# EAGLE schematic untitled (EAGLE 9.6.2)
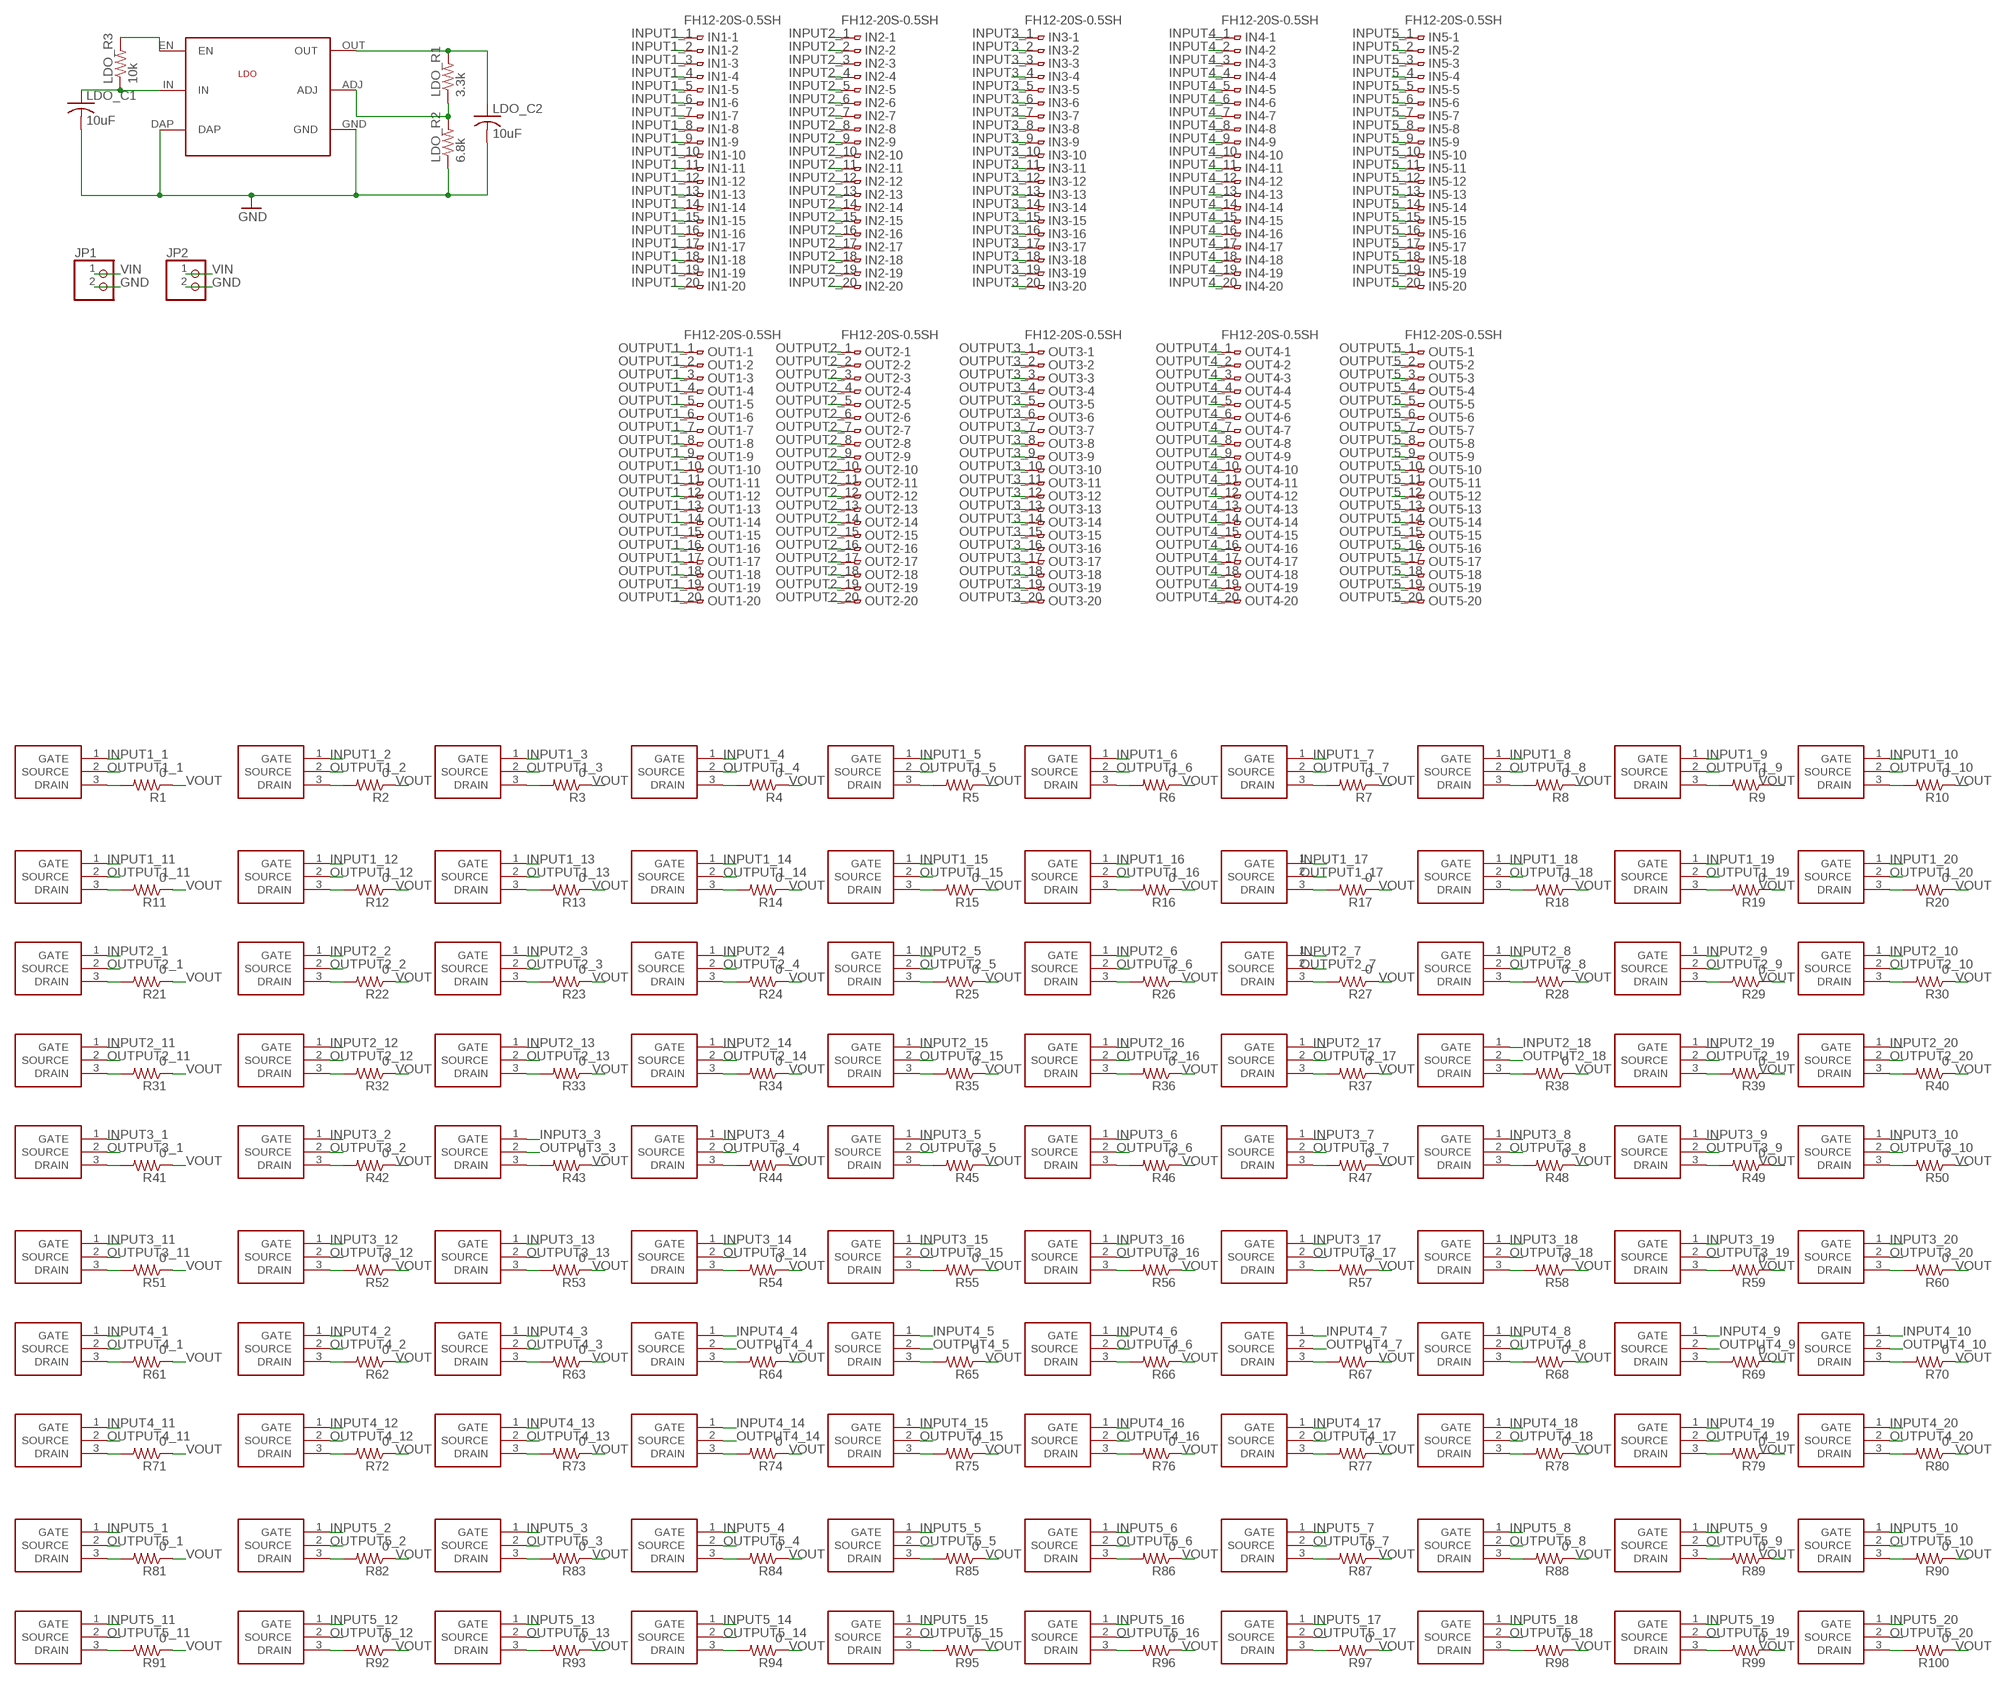
[diagram p0: schematic, sheet 1]

## Parts
IN1  FH12-20S-0.5SH  [FH12-20S-0.5SH]
IN2  FH12-20S-0.5SH  [FH12-20S-0.5SH]
IN3  FH12-20S-0.5SH  [FH12-20S-0.5SH]
IN4  FH12-20S-0.5SH  [FH12-20S-0.5SH]
IN5  FH12-20S-0.5SH  [FH12-20S-0.5SH]
JP1  PINHD-1X2  [1X02]
JP2  PINHD-1X2  [1X02]
LDO  LP38501TS_ADJ  [LP38501TS_ADJ]
LDO_C1  10uF  C-USC0805  [C0805]
LDO_C2  10uF  C-USC0805  [C0805]
LDO_R1  3.3k  R-US_R0805  [R0805]
LDO_R2  6.8k  R-US_R0805  [R0805]
LDO_R3  10k  R-US_R0805  [R0805]
MOS1  NX6008NBKNX6008NBK  [SOT95P240X110-3N]
MOS2  NX6008NBKNX6008NBK  [SOT95P240X110-3N]
MOS3  NX6008NBKNX6008NBK  [SOT95P240X110-3N]
MOS4  NX6008NBKNX6008NBK  [SOT95P240X110-3N]
MOS5  NX6008NBKNX6008NBK  [SOT95P240X110-3N]
MOS6  NX6008NBKNX6008NBK  [SOT95P240X110-3N]
MOS7  NX6008NBKNX6008NBK  [SOT95P240X110-3N]
MOS8  NX6008NBKNX6008NBK  [SOT95P240X110-3N]
MOS9  NX6008NBKNX6008NBK  [SOT95P240X110-3N]
MOS10  NX6008NBKNX6008NBK  [SOT95P240X110-3N]
MOS11  NX6008NBKNX6008NBK  [SOT95P240X110-3N]
MOS12  NX6008NBKNX6008NBK  [SOT95P240X110-3N]
MOS13  NX6008NBKNX6008NBK  [SOT95P240X110-3N]
MOS14  NX6008NBKNX6008NBK  [SOT95P240X110-3N]
MOS15  NX6008NBKNX6008NBK  [SOT95P240X110-3N]
MOS16  NX6008NBKNX6008NBK  [SOT95P240X110-3N]
MOS17  NX6008NBKNX6008NBK  [SOT95P240X110-3N]
MOS18  NX6008NBKNX6008NBK  [SOT95P240X110-3N]
MOS19  NX6008NBKNX6008NBK  [SOT95P240X110-3N]
MOS20  NX6008NBKNX6008NBK  [SOT95P240X110-3N]
MOS21  NX6008NBKNX6008NBK  [SOT95P240X110-3N]
MOS22  NX6008NBKNX6008NBK  [SOT95P240X110-3N]
MOS23  NX6008NBKNX6008NBK  [SOT95P240X110-3N]
MOS24  NX6008NBKNX6008NBK  [SOT95P240X110-3N]
MOS25  NX6008NBKNX6008NBK  [SOT95P240X110-3N]
MOS26  NX6008NBKNX6008NBK  [SOT95P240X110-3N]
MOS27  NX6008NBKNX6008NBK  [SOT95P240X110-3N]
MOS28  NX6008NBKNX6008NBK  [SOT95P240X110-3N]
MOS29  NX6008NBKNX6008NBK  [SOT95P240X110-3N]
MOS30  NX6008NBKNX6008NBK  [SOT95P240X110-3N]
MOS31  NX6008NBKNX6008NBK  [SOT95P240X110-3N]
MOS32  NX6008NBKNX6008NBK  [SOT95P240X110-3N]
MOS33  NX6008NBKNX6008NBK  [SOT95P240X110-3N]
MOS34  NX6008NBKNX6008NBK  [SOT95P240X110-3N]
MOS35  NX6008NBKNX6008NBK  [SOT95P240X110-3N]
MOS36  NX6008NBKNX6008NBK  [SOT95P240X110-3N]
MOS37  NX6008NBKNX6008NBK  [SOT95P240X110-3N]
MOS38  NX6008NBKNX6008NBK  [SOT95P240X110-3N]
MOS39  NX6008NBKNX6008NBK  [SOT95P240X110-3N]
MOS40  NX6008NBKNX6008NBK  [SOT95P240X110-3N]
MOS41  NX6008NBKNX6008NBK  [SOT95P240X110-3N]
MOS42  NX6008NBKNX6008NBK  [SOT95P240X110-3N]
MOS43  NX6008NBKNX6008NBK  [SOT95P240X110-3N]
MOS44  NX6008NBKNX6008NBK  [SOT95P240X110-3N]
MOS45  NX6008NBKNX6008NBK  [SOT95P240X110-3N]
MOS46  NX6008NBKNX6008NBK  [SOT95P240X110-3N]
MOS47  NX6008NBKNX6008NBK  [SOT95P240X110-3N]
MOS48  NX6008NBKNX6008NBK  [SOT95P240X110-3N]
MOS49  NX6008NBKNX6008NBK  [SOT95P240X110-3N]
MOS50  NX6008NBKNX6008NBK  [SOT95P240X110-3N]
MOS51  NX6008NBKNX6008NBK  [SOT95P240X110-3N]
MOS52  NX6008NBKNX6008NBK  [SOT95P240X110-3N]
MOS53  NX6008NBKNX6008NBK  [SOT95P240X110-3N]
MOS54  NX6008NBKNX6008NBK  [SOT95P240X110-3N]
MOS55  NX6008NBKNX6008NBK  [SOT95P240X110-3N]
MOS56  NX6008NBKNX6008NBK  [SOT95P240X110-3N]
MOS57  NX6008NBKNX6008NBK  [SOT95P240X110-3N]
MOS58  NX6008NBKNX6008NBK  [SOT95P240X110-3N]
MOS59  NX6008NBKNX6008NBK  [SOT95P240X110-3N]
MOS60  NX6008NBKNX6008NBK  [SOT95P240X110-3N]
MOS61  NX6008NBKNX6008NBK  [SOT95P240X110-3N]
MOS62  NX6008NBKNX6008NBK  [SOT95P240X110-3N]
MOS63  NX6008NBKNX6008NBK  [SOT95P240X110-3N]
MOS64  NX6008NBKNX6008NBK  [SOT95P240X110-3N]
MOS65  NX6008NBKNX6008NBK  [SOT95P240X110-3N]
MOS66  NX6008NBKNX6008NBK  [SOT95P240X110-3N]
MOS67  NX6008NBKNX6008NBK  [SOT95P240X110-3N]
MOS68  NX6008NBKNX6008NBK  [SOT95P240X110-3N]
MOS69  NX6008NBKNX6008NBK  [SOT95P240X110-3N]
MOS70  NX6008NBKNX6008NBK  [SOT95P240X110-3N]
MOS71  NX6008NBKNX6008NBK  [SOT95P240X110-3N]
MOS72  NX6008NBKNX6008NBK  [SOT95P240X110-3N]
MOS73  NX6008NBKNX6008NBK  [SOT95P240X110-3N]
MOS74  NX6008NBKNX6008NBK  [SOT95P240X110-3N]
MOS75  NX6008NBKNX6008NBK  [SOT95P240X110-3N]
MOS76  NX6008NBKNX6008NBK  [SOT95P240X110-3N]
MOS77  NX6008NBKNX6008NBK  [SOT95P240X110-3N]
MOS78  NX6008NBKNX6008NBK  [SOT95P240X110-3N]
MOS79  NX6008NBKNX6008NBK  [SOT95P240X110-3N]
MOS80  NX6008NBKNX6008NBK  [SOT95P240X110-3N]
MOS81  NX6008NBKNX6008NBK  [SOT95P240X110-3N]
MOS82  NX6008NBKNX6008NBK  [SOT95P240X110-3N]
MOS83  NX6008NBKNX6008NBK  [SOT95P240X110-3N]
MOS84  NX6008NBKNX6008NBK  [SOT95P240X110-3N]
MOS85  NX6008NBKNX6008NBK  [SOT95P240X110-3N]
MOS86  NX6008NBKNX6008NBK  [SOT95P240X110-3N]
MOS87  NX6008NBKNX6008NBK  [SOT95P240X110-3N]
MOS88  NX6008NBKNX6008NBK  [SOT95P240X110-3N]
MOS89  NX6008NBKNX6008NBK  [SOT95P240X110-3N]
MOS90  NX6008NBKNX6008NBK  [SOT95P240X110-3N]
MOS91  NX6008NBKNX6008NBK  [SOT95P240X110-3N]
MOS92  NX6008NBKNX6008NBK  [SOT95P240X110-3N]
MOS93  NX6008NBKNX6008NBK  [SOT95P240X110-3N]
MOS94  NX6008NBKNX6008NBK  [SOT95P240X110-3N]
MOS95  NX6008NBKNX6008NBK  [SOT95P240X110-3N]
MOS96  NX6008NBKNX6008NBK  [SOT95P240X110-3N]
MOS97  NX6008NBKNX6008NBK  [SOT95P240X110-3N]
MOS98  NX6008NBKNX6008NBK  [SOT95P240X110-3N]
MOS99  NX6008NBKNX6008NBK  [SOT95P240X110-3N]
MOS100  NX6008NBKNX6008NBK  [SOT95P240X110-3N]
OUT1  FH12-20S-0.5SH  [FH12-20S-0.5SH]
OUT2  FH12-20S-0.5SH  [FH12-20S-0.5SH]
OUT3  FH12-20S-0.5SH  [FH12-20S-0.5SH]
OUT4  FH12-20S-0.5SH  [FH12-20S-0.5SH]
OUT5  FH12-20S-0.5SH  [FH12-20S-0.5SH]
R1  0  R-US_R0805  [R0805]
R2  0  R-US_R0805  [R0805]
R3  0  R-US_R0805  [R0805]
R4  0  R-US_R0805  [R0805]
R5  0  R-US_R0805  [R0805]
R6  0  R-US_R0805  [R0805]
R7  0  R-US_R0805  [R0805]
R8  0  R-US_R0805  [R0805]
R9  0  R-US_R0805  [R0805]
R10  0  R-US_R0805  [R0805]
R11  0  R-US_R0805  [R0805]
R12  0  R-US_R0805  [R0805]
R13  0  R-US_R0805  [R0805]
R14  0  R-US_R0805  [R0805]
R15  0  R-US_R0805  [R0805]
R16  0  R-US_R0805  [R0805]
R17  0  R-US_R0805  [R0805]
R18  0  R-US_R0805  [R0805]
R19  0  R-US_R0805  [R0805]
R20  0  R-US_R0805  [R0805]
R21  0  R-US_R0805  [R0805]
R22  0  R-US_R0805  [R0805]
R23  0  R-US_R0805  [R0805]
R24  0  R-US_R0805  [R0805]
R25  0  R-US_R0805  [R0805]
R26  0  R-US_R0805  [R0805]
R27  0  R-US_R0805  [R0805]
R28  0  R-US_R0805  [R0805]
R29  0  R-US_R0805  [R0805]
R30  0  R-US_R0805  [R0805]
R31  0  R-US_R0805  [R0805]
R32  0  R-US_R0805  [R0805]
R33  0  R-US_R0805  [R0805]
R34  0  R-US_R0805  [R0805]
R35  0  R-US_R0805  [R0805]
R36  0  R-US_R0805  [R0805]
R37  0  R-US_R0805  [R0805]
R38  0  R-US_R0805  [R0805]
R39  0  R-US_R0805  [R0805]
R40  0  R-US_R0805  [R0805]
R41  0  R-US_R0805  [R0805]
R42  0  R-US_R0805  [R0805]
R43  0  R-US_R0805  [R0805]
R44  0  R-US_R0805  [R0805]
R45  0  R-US_R0805  [R0805]
R46  0  R-US_R0805  [R0805]
R47  0  R-US_R0805  [R0805]
R48  0  R-US_R0805  [R0805]
R49  0  R-US_R0805  [R0805]
R50  0  R-US_R0805  [R0805]
R51  0  R-US_R0805  [R0805]
R52  0  R-US_R0805  [R0805]
R53  0  R-US_R0805  [R0805]
R54  0  R-US_R0805  [R0805]
R55  0  R-US_R0805  [R0805]
R56  0  R-US_R0805  [R0805]
R57  0  R-US_R0805  [R0805]
R58  0  R-US_R0805  [R0805]
R59  0  R-US_R0805  [R0805]
R60  0  R-US_R0805  [R0805]
R61  0  R-US_R0805  [R0805]
R62  0  R-US_R0805  [R0805]
R63  0  R-US_R0805  [R0805]
R64  0  R-US_R0805  [R0805]
R65  0  R-US_R0805  [R0805]
R66  0  R-US_R0805  [R0805]
R67  0  R-US_R0805  [R0805]
R68  0  R-US_R0805  [R0805]
R69  0  R-US_R0805  [R0805]
R70  0  R-US_R0805  [R0805]
R71  0  R-US_R0805  [R0805]
R72  0  R-US_R0805  [R0805]
R73  0  R-US_R0805  [R0805]
R74  0  R-US_R0805  [R0805]
R75  0  R-US_R0805  [R0805]
R76  0  R-US_R0805  [R0805]
R77  0  R-US_R0805  [R0805]
R78  0  R-US_R0805  [R0805]
R79  0  R-US_R0805  [R0805]
R80  0  R-US_R0805  [R0805]
R81  0  R-US_R0805  [R0805]
R82  0  R-US_R0805  [R0805]
R83  0  R-US_R0805  [R0805]
R84  0  R-US_R0805  [R0805]
R85  0  R-US_R0805  [R0805]
R86  0  R-US_R0805  [R0805]
R87  0  R-US_R0805  [R0805]
R88  0  R-US_R0805  [R0805]
R89  0  R-US_R0805  [R0805]
R90  0  R-US_R0805  [R0805]
R91  0  R-US_R0805  [R0805]
R92  0  R-US_R0805  [R0805]
R93  0  R-US_R0805  [R0805]
R94  0  R-US_R0805  [R0805]
R95  0  R-US_R0805  [R0805]
R96  0  R-US_R0805  [R0805]
R97  0  R-US_R0805  [R0805]
R98  0  R-US_R0805  [R0805]
R99  0  R-US_R0805  [R0805]
R100  0  R-US_R0805  [R0805]

## Nets
GND: JP1.2 JP2.2 LDO.DAP LDO.GND LDO_C1.2 LDO_C2.2 LDO_R2.1
INPUT1_1: IN1.1 MOS1.1(GATE)
INPUT1_2: IN1.2 MOS2.1(GATE)
INPUT1_3: IN1.3 MOS3.1(GATE)
INPUT1_4: IN1.4 MOS4.1(GATE)
INPUT1_5: IN1.5 MOS5.1(GATE)
INPUT1_6: IN1.6 MOS6.1(GATE)
INPUT1_7: IN1.7 MOS7.1(GATE)
INPUT1_8: IN1.8 MOS8.1(GATE)
INPUT1_9: IN1.9 MOS9.1(GATE)
INPUT1_10: IN1.10 MOS10.1(GATE)
INPUT1_11: IN1.11 MOS11.1(GATE)
INPUT1_12: IN1.12 MOS12.1(GATE)
INPUT1_13: IN1.13 MOS13.1(GATE)
INPUT1_14: IN1.14 MOS14.1(GATE)
INPUT1_15: IN1.15 MOS15.1(GATE)
INPUT1_16: IN1.16 MOS16.1(GATE)
INPUT1_17: IN1.17 MOS17.1(GATE)
INPUT1_18: IN1.18 MOS18.1(GATE)
INPUT1_19: IN1.19 MOS19.1(GATE)
INPUT1_20: IN1.20 MOS20.1(GATE)
INPUT2_1: IN2.1 MOS21.1(GATE)
INPUT2_2: IN2.2 MOS22.1(GATE)
INPUT2_3: IN2.3 MOS23.1(GATE)
INPUT2_4: IN2.4 MOS24.1(GATE)
INPUT2_5: IN2.5 MOS25.1(GATE)
INPUT2_6: IN2.6 MOS26.1(GATE)
INPUT2_7: IN2.7 MOS27.1(GATE)
INPUT2_8: IN2.8 MOS28.1(GATE)
INPUT2_9: IN2.9 MOS29.1(GATE)
INPUT2_10: IN2.10 MOS30.1(GATE)
INPUT2_11: IN2.11 MOS31.1(GATE)
INPUT2_12: IN2.12 MOS32.1(GATE)
INPUT2_13: IN2.13 MOS33.1(GATE)
INPUT2_14: IN2.14 MOS34.1(GATE)
INPUT2_15: IN2.15 MOS35.1(GATE)
INPUT2_16: IN2.16 MOS36.1(GATE)
INPUT2_17: IN2.17 MOS37.1(GATE)
INPUT2_18: IN2.18 MOS38.1(GATE)
INPUT2_19: IN2.19 MOS39.1(GATE)
INPUT2_20: IN2.20 MOS40.1(GATE)
INPUT3_1: IN3.1 MOS41.1(GATE)
INPUT3_2: IN3.2 MOS42.1(GATE)
INPUT3_3: IN3.3 MOS43.1(GATE)
INPUT3_4: IN3.4 MOS44.1(GATE)
INPUT3_5: IN3.5 MOS45.1(GATE)
INPUT3_6: IN3.6 MOS46.1(GATE)
INPUT3_7: IN3.7 MOS47.1(GATE)
INPUT3_8: IN3.8 MOS48.1(GATE)
INPUT3_9: IN3.9 MOS49.1(GATE)
INPUT3_10: IN3.10 MOS50.1(GATE)
INPUT3_11: IN3.11 MOS51.1(GATE)
INPUT3_12: IN3.12 MOS52.1(GATE)
INPUT3_13: IN3.13 MOS53.1(GATE)
INPUT3_14: IN3.14 MOS54.1(GATE)
INPUT3_15: IN3.15 MOS55.1(GATE)
INPUT3_16: IN3.16 MOS56.1(GATE)
INPUT3_17: IN3.17 MOS57.1(GATE)
INPUT3_18: IN3.18 MOS58.1(GATE)
INPUT3_19: IN3.19 MOS59.1(GATE)
INPUT3_20: IN3.20 MOS60.1(GATE)
INPUT4_1: IN4.1 MOS61.1(GATE)
INPUT4_2: IN4.2 MOS62.1(GATE)
INPUT4_3: IN4.3 MOS63.1(GATE)
INPUT4_4: IN4.4 MOS64.1(GATE)
INPUT4_5: IN4.5 MOS65.1(GATE)
INPUT4_6: IN4.6 MOS66.1(GATE)
INPUT4_7: IN4.7 MOS67.1(GATE)
INPUT4_8: IN4.8 MOS68.1(GATE)
INPUT4_9: IN4.9 MOS69.1(GATE)
INPUT4_10: IN4.10 MOS70.1(GATE)
INPUT4_11: IN4.11 MOS71.1(GATE)
INPUT4_12: IN4.12 MOS72.1(GATE)
INPUT4_13: IN4.13 MOS73.1(GATE)
INPUT4_14: IN4.14 MOS74.1(GATE)
INPUT4_15: IN4.15 MOS75.1(GATE)
INPUT4_16: IN4.16 MOS76.1(GATE)
INPUT4_17: IN4.17 MOS77.1(GATE)
INPUT4_18: IN4.18 MOS78.1(GATE)
INPUT4_19: IN4.19 MOS79.1(GATE)
INPUT4_20: IN4.20 MOS80.1(GATE)
INPUT5_1: IN5.1 MOS81.1(GATE)
INPUT5_2: IN5.2 MOS82.1(GATE)
INPUT5_3: IN5.3 MOS83.1(GATE)
INPUT5_4: IN5.4 MOS84.1(GATE)
INPUT5_5: IN5.5 MOS85.1(GATE)
INPUT5_6: IN5.6 MOS86.1(GATE)
INPUT5_7: IN5.7 MOS87.1(GATE)
INPUT5_8: IN5.8 MOS88.1(GATE)
INPUT5_9: IN5.9 MOS89.1(GATE)
INPUT5_10: IN5.10 MOS90.1(GATE)
INPUT5_11: IN5.11 MOS91.1(GATE)
INPUT5_12: IN5.12 MOS92.1(GATE)
INPUT5_13: IN5.13 MOS93.1(GATE)
INPUT5_14: IN5.14 MOS94.1(GATE)
INPUT5_15: IN5.15 MOS95.1(GATE)
INPUT5_16: IN5.16 MOS96.1(GATE)
INPUT5_17: IN5.17 MOS97.1(GATE)
INPUT5_18: IN5.18 MOS98.1(GATE)
INPUT5_19: IN5.19 MOS99.1(GATE)
INPUT5_20: IN5.20 MOS100.1(GATE)
N$1: LDO.EN LDO_R3.2
N$2: MOS77.3(DRAIN) R77.2
N$3: MOS81.3(DRAIN) R81.2
N$4: LDO.ADJ LDO_R1.1 LDO_R2.2
N$5: MOS1.3(DRAIN) R1.2
N$6: MOS2.3(DRAIN) R2.2
N$7: MOS82.3(DRAIN) R82.2
N$8: MOS83.3(DRAIN) R83.2
N$9: MOS84.3(DRAIN) R84.2
N$10: MOS3.3(DRAIN) R3.2
N$11: MOS85.3(DRAIN) R85.2
N$12: MOS86.3(DRAIN) R86.2
N$13: MOS87.3(DRAIN) R87.2
N$14: MOS4.3(DRAIN) R4.2
N$15: MOS88.3(DRAIN) R88.2
N$16: MOS89.3(DRAIN) R89.2
N$17: MOS90.3(DRAIN) R90.2
N$18: MOS5.3(DRAIN) R5.2
N$19: MOS91.3(DRAIN) R91.2
N$20: MOS92.3(DRAIN) R92.2
N$21: MOS93.3(DRAIN) R93.2
N$22: MOS6.3(DRAIN) R6.2
N$23: MOS94.3(DRAIN) R94.2
N$24: MOS95.3(DRAIN) R95.2
N$25: MOS96.3(DRAIN) R96.2
N$26: MOS7.3(DRAIN) R7.2
N$27: MOS98.3(DRAIN) R98.2
N$28: MOS99.3(DRAIN) R99.2
N$29: MOS100.3(DRAIN) R100.2
N$30: MOS8.3(DRAIN) R8.2
N$31: MOS97.3(DRAIN) R97.2
N$34: MOS9.3(DRAIN) R9.2
N$38: MOS10.3(DRAIN) R10.2
N$40: MOS11.3(DRAIN) R11.2
N$43: MOS12.3(DRAIN) R12.2
N$47: MOS13.3(DRAIN) R13.2
N$51: MOS14.3(DRAIN) R14.2
N$55: MOS15.3(DRAIN) R15.2
N$59: MOS16.3(DRAIN) R16.2
N$63: MOS17.3(DRAIN) R17.2
N$67: MOS18.3(DRAIN) R18.2
N$71: MOS19.3(DRAIN) R19.2
N$75: MOS20.3(DRAIN) R20.2
N$77: MOS21.3(DRAIN) R21.2
N$80: MOS22.3(DRAIN) R22.2
N$84: MOS23.3(DRAIN) R23.2
N$88: MOS24.3(DRAIN) R24.2
N$92: MOS25.3(DRAIN) R25.2
N$96: MOS26.3(DRAIN) R26.2
N$100: MOS27.3(DRAIN) R27.2
N$104: MOS28.3(DRAIN) R28.2
N$108: MOS29.3(DRAIN) R29.2
N$112: MOS30.3(DRAIN) R30.2
N$114: MOS31.3(DRAIN) R31.2
N$117: MOS32.3(DRAIN) R32.2
N$121: MOS33.3(DRAIN) R33.2
N$125: MOS34.3(DRAIN) R34.2
N$129: MOS35.3(DRAIN) R35.2
N$133: MOS36.3(DRAIN) R36.2
N$137: MOS37.3(DRAIN) R37.2
N$141: MOS38.3(DRAIN) R38.2
N$145: MOS39.3(DRAIN) R39.2
N$149: MOS40.3(DRAIN) R40.2
N$151: MOS41.3(DRAIN) R41.2
N$154: MOS42.3(DRAIN) R42.2
N$158: MOS43.3(DRAIN) R43.2
N$162: MOS44.3(DRAIN) R44.2
N$166: MOS45.3(DRAIN) R45.2
N$170: MOS46.3(DRAIN) R46.2
N$174: MOS47.3(DRAIN) R47.2
N$178: MOS48.3(DRAIN) R48.2
N$182: MOS49.3(DRAIN) R49.2
N$186: MOS50.3(DRAIN) R50.2
N$188: MOS51.3(DRAIN) R51.2
N$191: MOS52.3(DRAIN) R52.2
N$195: MOS53.3(DRAIN) R53.2
N$199: MOS54.3(DRAIN) R54.2
N$203: MOS55.3(DRAIN) R55.2
N$207: MOS56.3(DRAIN) R56.2
N$211: MOS57.3(DRAIN) R57.2
N$215: MOS58.3(DRAIN) R58.2
N$219: MOS59.3(DRAIN) R59.2
N$223: MOS60.3(DRAIN) R60.2
N$225: MOS61.3(DRAIN) R61.2
N$228: MOS62.3(DRAIN) R62.2
N$232: MOS63.3(DRAIN) R63.2
N$236: MOS64.3(DRAIN) R64.2
N$240: MOS65.3(DRAIN) R65.2
N$244: MOS66.3(DRAIN) R66.2
N$248: MOS67.3(DRAIN) R67.2
N$252: MOS68.3(DRAIN) R68.2
N$256: MOS69.3(DRAIN) R69.2
N$260: MOS70.3(DRAIN) R70.2
N$262: MOS71.3(DRAIN) R71.2
N$265: MOS72.3(DRAIN) R72.2
N$269: MOS73.3(DRAIN) R73.2
N$273: MOS74.3(DRAIN) R74.2
N$277: MOS75.3(DRAIN) R75.2
N$281: MOS76.3(DRAIN) R76.2
N$289: MOS78.3(DRAIN) R78.2
N$293: MOS79.3(DRAIN) R79.2
N$297: MOS80.3(DRAIN) R80.2
OUTPUT1_1: MOS1.2(SOURCE) OUT1.1
OUTPUT1_2: MOS2.2(SOURCE) OUT1.2
OUTPUT1_3: MOS3.2(SOURCE) OUT1.3
OUTPUT1_4: MOS4.2(SOURCE) OUT1.4
OUTPUT1_5: MOS5.2(SOURCE) OUT1.5
OUTPUT1_6: MOS6.2(SOURCE) OUT1.6
OUTPUT1_7: MOS7.2(SOURCE) OUT1.7
OUTPUT1_8: MOS8.2(SOURCE) OUT1.8
OUTPUT1_9: MOS9.2(SOURCE) OUT1.9
OUTPUT1_10: MOS10.2(SOURCE) OUT1.10
OUTPUT1_11: MOS11.2(SOURCE) OUT1.11
OUTPUT1_12: MOS12.2(SOURCE) OUT1.12
OUTPUT1_13: MOS13.2(SOURCE) OUT1.13
OUTPUT1_14: MOS14.2(SOURCE) OUT1.14
OUTPUT1_15: MOS15.2(SOURCE) OUT1.15
OUTPUT1_16: MOS16.2(SOURCE) OUT1.16
OUTPUT1_17: MOS17.2(SOURCE) OUT1.17
OUTPUT1_18: MOS18.2(SOURCE) OUT1.18
OUTPUT1_19: MOS19.2(SOURCE) OUT1.19
OUTPUT1_20: MOS20.2(SOURCE) OUT1.20
OUTPUT2_1: MOS21.2(SOURCE) OUT2.1
OUTPUT2_2: MOS22.2(SOURCE) OUT2.2
OUTPUT2_3: MOS23.2(SOURCE) OUT2.3
OUTPUT2_4: MOS24.2(SOURCE) OUT2.4
OUTPUT2_5: MOS25.2(SOURCE) OUT2.5
OUTPUT2_6: MOS26.2(SOURCE) OUT2.6
OUTPUT2_7: MOS27.2(SOURCE) OUT2.7
OUTPUT2_8: MOS28.2(SOURCE) OUT2.8
OUTPUT2_9: MOS29.2(SOURCE) OUT2.9
OUTPUT2_10: MOS30.2(SOURCE) OUT2.10
OUTPUT2_11: MOS31.2(SOURCE) OUT2.11
OUTPUT2_12: MOS32.2(SOURCE) OUT2.12
OUTPUT2_13: MOS33.2(SOURCE) OUT2.13
OUTPUT2_14: MOS34.2(SOURCE) OUT2.14
OUTPUT2_15: MOS35.2(SOURCE) OUT2.15
OUTPUT2_16: MOS36.2(SOURCE) OUT2.16
OUTPUT2_17: MOS37.2(SOURCE) OUT2.17
OUTPUT2_18: MOS38.2(SOURCE) OUT2.18
OUTPUT2_19: MOS39.2(SOURCE) OUT2.19
OUTPUT2_20: MOS40.2(SOURCE) OUT2.20
OUTPUT3_1: MOS41.2(SOURCE) OUT3.1
OUTPUT3_2: MOS42.2(SOURCE) OUT3.2
OUTPUT3_3: MOS43.2(SOURCE) OUT3.3
OUTPUT3_4: MOS44.2(SOURCE) OUT3.4
OUTPUT3_5: MOS45.2(SOURCE) OUT3.5
OUTPUT3_6: MOS46.2(SOURCE) OUT3.6
OUTPUT3_7: MOS47.2(SOURCE) OUT3.7
OUTPUT3_8: MOS48.2(SOURCE) OUT3.8
OUTPUT3_9: MOS49.2(SOURCE) OUT3.9
OUTPUT3_10: MOS50.2(SOURCE) OUT3.10
OUTPUT3_11: MOS51.2(SOURCE) OUT3.11
OUTPUT3_12: MOS52.2(SOURCE) OUT3.12
OUTPUT3_13: MOS53.2(SOURCE) OUT3.13
OUTPUT3_14: MOS54.2(SOURCE) OUT3.14
OUTPUT3_15: MOS55.2(SOURCE) OUT3.15
OUTPUT3_16: MOS56.2(SOURCE) OUT3.16
OUTPUT3_17: MOS57.2(SOURCE) OUT3.17
OUTPUT3_18: MOS58.2(SOURCE) OUT3.18
OUTPUT3_19: MOS59.2(SOURCE) OUT3.19
OUTPUT3_20: MOS60.2(SOURCE) OUT3.20
OUTPUT4_1: MOS61.2(SOURCE) OUT4.1
OUTPUT4_2: MOS62.2(SOURCE) OUT4.2
OUTPUT4_3: MOS63.2(SOURCE) OUT4.3
OUTPUT4_4: MOS64.2(SOURCE) OUT4.4
OUTPUT4_5: MOS65.2(SOURCE) OUT4.5
OUTPUT4_6: MOS66.2(SOURCE) OUT4.6
OUTPUT4_7: MOS67.2(SOURCE) OUT4.7
OUTPUT4_8: MOS68.2(SOURCE) OUT4.8
OUTPUT4_9: MOS69.2(SOURCE) OUT4.9
OUTPUT4_10: MOS70.2(SOURCE) OUT4.10
OUTPUT4_11: MOS71.2(SOURCE) OUT4.11
OUTPUT4_12: MOS72.2(SOURCE) OUT4.12
OUTPUT4_13: MOS73.2(SOURCE) OUT4.13
OUTPUT4_14: MOS74.2(SOURCE) OUT4.14
OUTPUT4_15: MOS75.2(SOURCE) OUT4.15
OUTPUT4_16: MOS76.2(SOURCE) OUT4.16
OUTPUT4_17: MOS77.2(SOURCE) OUT4.17
OUTPUT4_18: MOS78.2(SOURCE) OUT4.18
OUTPUT4_19: MOS79.2(SOURCE) OUT4.19
OUTPUT4_20: MOS80.2(SOURCE) OUT4.20
OUTPUT5_1: MOS81.2(SOURCE) OUT5.1
OUTPUT5_2: MOS82.2(SOURCE) OUT5.2
OUTPUT5_3: MOS83.2(SOURCE) OUT5.3
OUTPUT5_4: MOS84.2(SOURCE) OUT5.4
OUTPUT5_5: MOS85.2(SOURCE) OUT5.5
OUTPUT5_6: MOS86.2(SOURCE) OUT5.6
OUTPUT5_7: MOS87.2(SOURCE) OUT5.7
OUTPUT5_8: MOS88.2(SOURCE) OUT5.8
OUTPUT5_9: MOS89.2(SOURCE) OUT5.9
OUTPUT5_10: MOS90.2(SOURCE) OUT5.10
OUTPUT5_11: MOS91.2(SOURCE) OUT5.11
OUTPUT5_12: MOS92.2(SOURCE) OUT5.12
OUTPUT5_13: MOS93.2(SOURCE) OUT5.13
OUTPUT5_14: MOS94.2(SOURCE) OUT5.14
OUTPUT5_15: MOS95.2(SOURCE) OUT5.15
OUTPUT5_16: MOS96.2(SOURCE) OUT5.16
OUTPUT5_17: MOS97.2(SOURCE) OUT5.17
OUTPUT5_18: MOS98.2(SOURCE) OUT5.18
OUTPUT5_19: MOS99.2(SOURCE) OUT5.19
OUTPUT5_20: MOS100.2(SOURCE) OUT5.20
VIN: JP1.1 JP2.1 LDO.IN LDO_C1.1 LDO_R3.1
VOUT: LDO.OUT LDO_C2.1 LDO_R1.2 R1.1 R2.1 R3.1 R4.1 R5.1 R6.1 R7.1 R8.1 R9.1 R10.1 R11.1 R12.1 R13.1 R14.1 R15.1 R16.1 R17.1 R18.1 R19.1 R20.1 R21.1 R22.1 R23.1 R24.1 R25.1 R26.1 R27.1 R28.1 R29.1 R30.1 R31.1 R32.1 R33.1 R34.1 R35.1 R36.1 R37.1 R38.1 R39.1 R40.1 R41.1 R42.1 R43.1 R44.1 R45.1 R46.1 R47.1 R48.1 R49.1 R50.1 R51.1 R52.1 R53.1 R54.1 R55.1 R56.1 R57.1 R58.1 R59.1 R60.1 R61.1 R62.1 R63.1 R64.1 R65.1 R66.1 R67.1 R68.1 R69.1 R70.1 R71.1 R72.1 R73.1 R74.1 R75.1 R76.1 R77.1 R78.1 R79.1 R80.1 R81.1 R82.1 R83.1 R84.1 R85.1 R86.1 R87.1 R88.1 R89.1 R90.1 R91.1 R92.1 R93.1 R94.1 R95.1 R96.1 R97.1 R98.1 R99.1 R100.1

## Library data of the parts
IN1-IN5 OUT1-OUT5 = con-hirose:FH12-20S-0.5S: 0.5mm Pitch Connectors For FPC/FFC Source: Data sheet <http://www.hirose.co.jp/cataloge_hp/e58605370.pdf>; MPN: FH12-20S-0.5SH(55); OC_FARNELL: 1324549; OC_NEWARK: 34M6166
JP1 JP2 = pinhead:PINHD-1X2: PIN HEADER
LDO = LP38501TS_ADJ_byHsia:LP38501TS_ADJ
LDO_C1 LDO_C2 = rcl:C-US: CAPACITOR, American symbol; SPICEPREFIX: C
LDO_R1-LDO_R3 R1-R100 = rcl:R-US_: RESISTOR, American symbol; SPICEPREFIX: R
MOS1-MOS100 = NX6008NBK_byHsia:NX6008NBK